# Altium schematic sheet Sheet3.SchDoc
size D
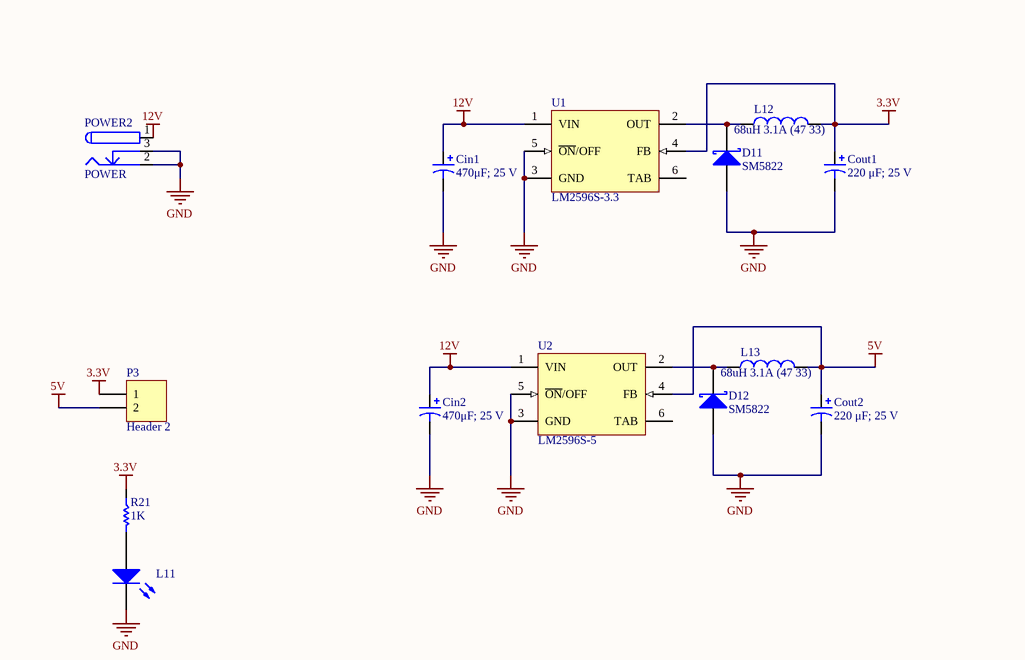
[diagram p0: Sheet3.SchDoc, top left]
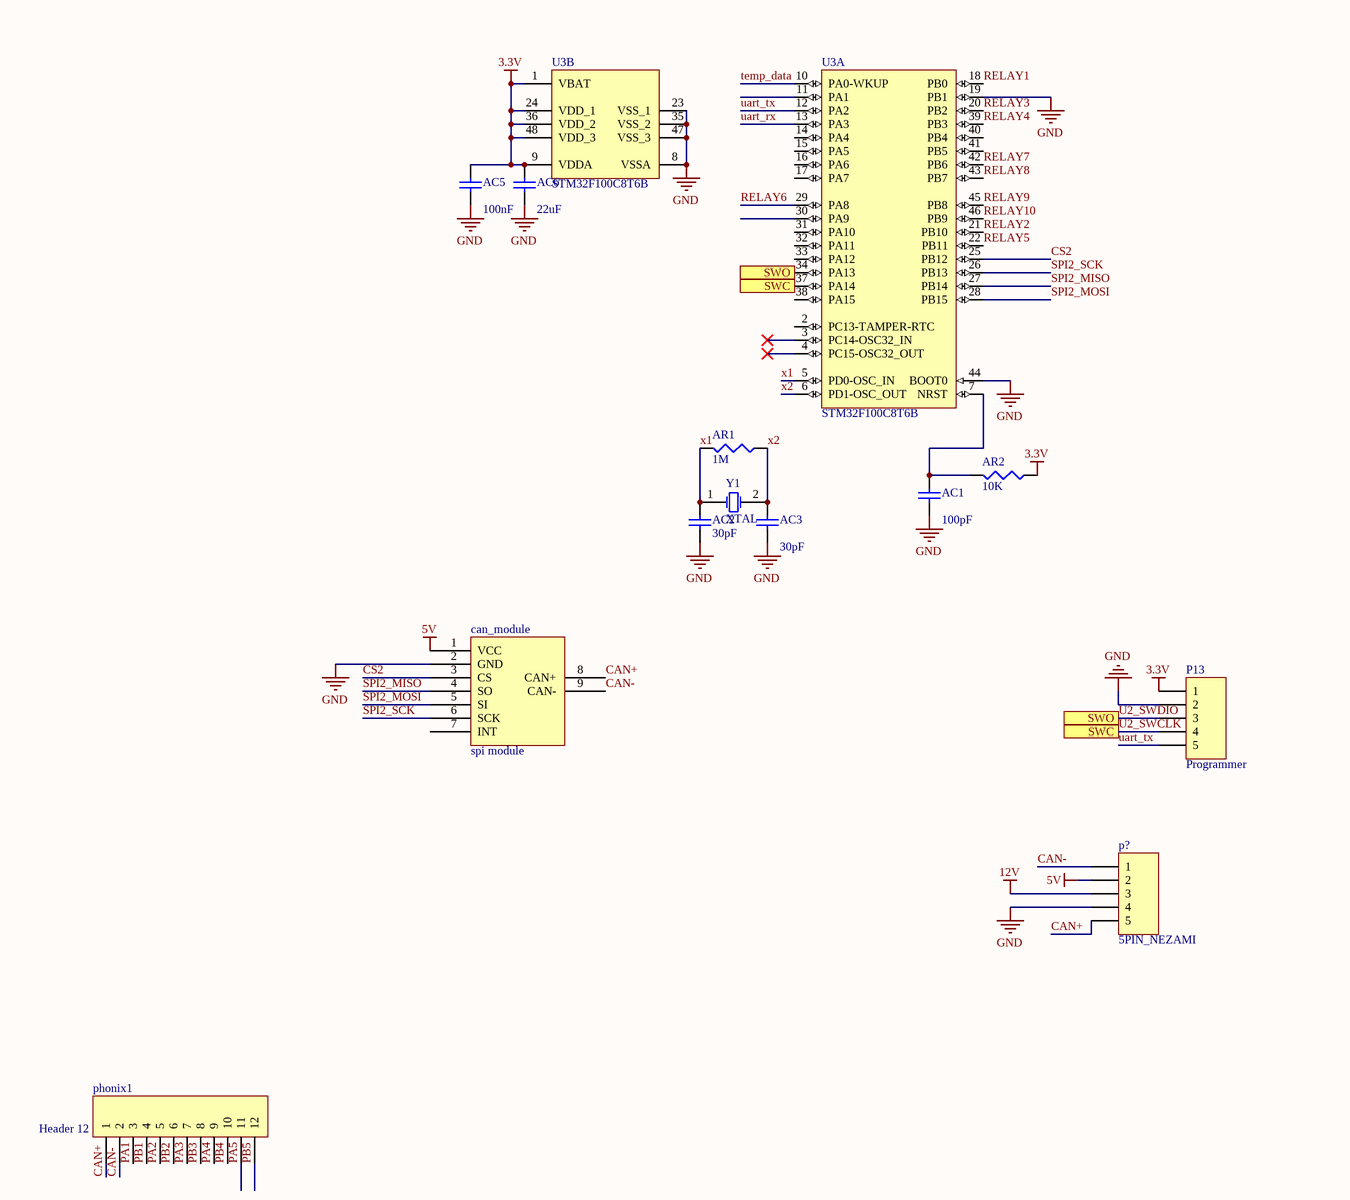
[diagram p1: Sheet3.SchDoc, top right]
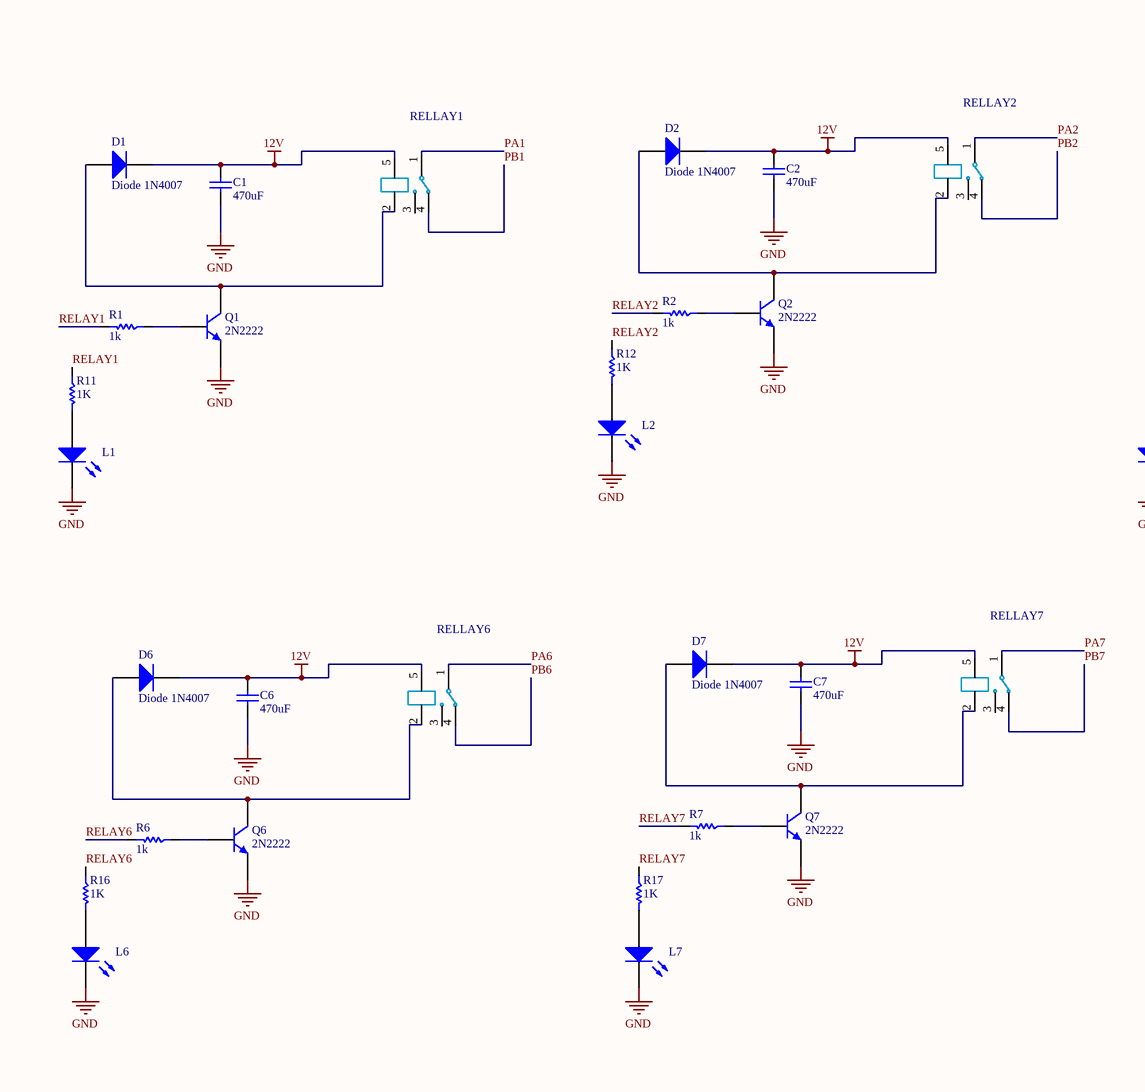
[diagram p2: Sheet3.SchDoc, bottom left]
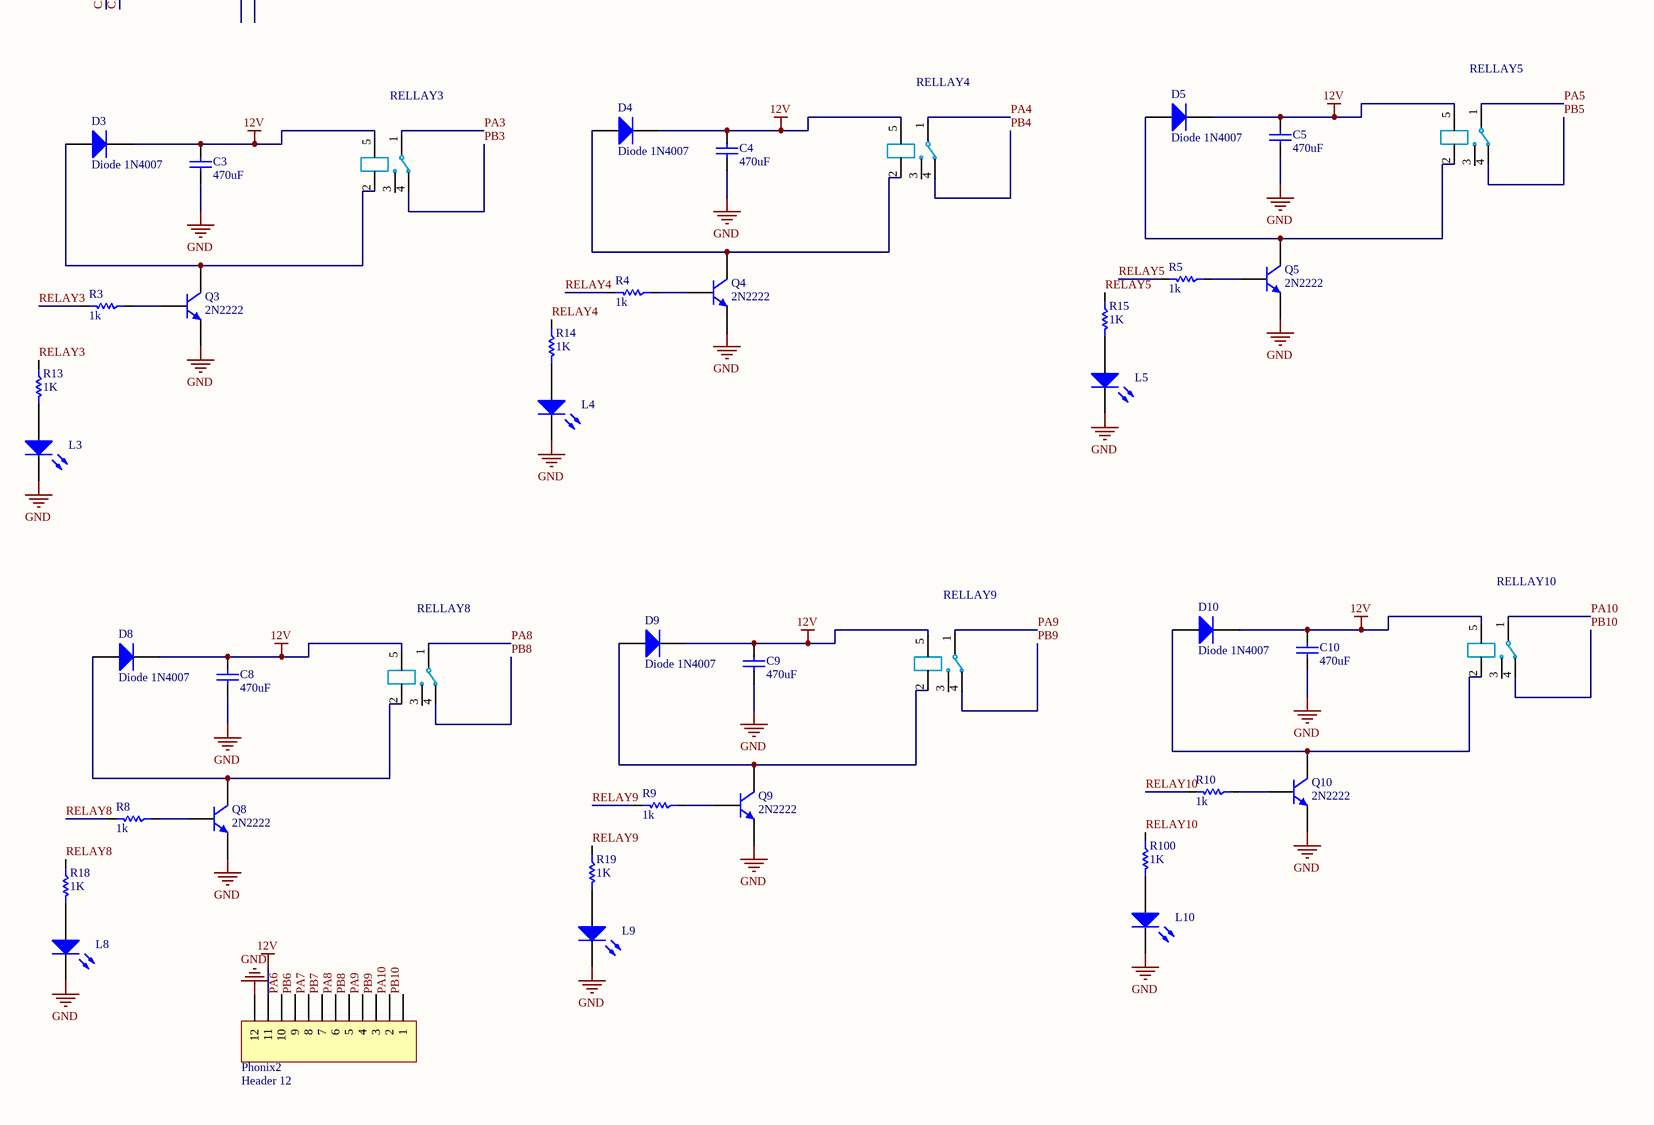
[diagram p3: Sheet3.SchDoc, bottom right]

## Parts
AC1  value 100pF  [C1206]  (hidden comment: Cap Semi)
AC2  value 30pF  [C1206]  (hidden comment: Cap Semi)
AC3  value 30pF  [C1206]  (hidden comment: Cap Semi)
AC5  value 100nF  [C1206]  (hidden comment: Cap Semi)
AC6  value 22uF  [C1206]  (hidden comment: Cap Semi)
AR1  value 1M  [c1206]  (hidden comment: Res3)
AR2  value 10K  [c1206]  (hidden comment: Res3)
C1  470uF  [F]
C2  470uF  [F]
C3  470uF  [F]
C4  470uF  [F]
C5  470uF  [F]
C6  470uF  [F]
C7  470uF  [F]
C8  470uF  [F]
C9  470uF  [F]
C10  470uF  [F]
can_module  spi module  [SPI_CAN]
Cin1  470μF; 25 V  [E]
Cin2  470μF; 25 V  [E]
Cout1  220 μF; 25 V  [E]
Cout2  220 μF; 25 V  [E]
D1  Diode 1N4007  [DO-41]
D2  Diode 1N4007  [DO-41]
D3  Diode 1N4007  [DO-41]
D4  Diode 1N4007  [DO-41]
D5  Diode 1N4007  [DO-41]
D6  Diode 1N4007  [DO-41]
D7  Diode 1N4007  [DO-41]
D8  Diode 1N4007  [DO-41]
D9  Diode 1N4007  [DO-41]
D10  Diode 1N4007  [DO-41]
D11  SM5822  [SMB]
D12  SM5822  [SMB]
L1  LED2  [LED]  (value not drawn)
L2  LED2  [LED]  (value not drawn)
L3  LED2  [LED]  (value not drawn)
L4  LED2  [LED]  (value not drawn)
L5  LED2  [LED]  (value not drawn)
L6  LED2  [LED]  (value not drawn)
L7  LED2  [LED]  (value not drawn)
L8  LED2  [LED]  (value not drawn)
L9  LED2  [LED]  (value not drawn)
L10  LED2  [LED]  (value not drawn)
L11  LED2  [LED]  (value not drawn)
L12  68uH 3.1A (47 33)  [CAPR5-4X5]
L13  68uH 3.1A (47 33)  [CAPR5-4X5]
P3  Header 2  [HDR1X2]
P13  Programmer  [HDR1X5]
p?  5PIN_NEZAMI  [5PIN_NEZAMI_CAN]
phonix1  Header 12  [phoenix terminal R 10]
Phonix2  Header 12  [phoenix terminal R 10]
POWER2  POWER  [POWERIN]
Q1  2N2222  [TO-92A]
Q2  2N2222  [TO-92A]
Q3  2N2222  [TO-92A]
Q4  2N2222  [TO-92A]
Q5  2N2222  [TO-92A]
Q6  2N2222  [TO-92A]
Q7  2N2222  [TO-92A]
Q8  2N2222  [TO-92A]
Q9  2N2222  [TO-92A]
Q10  2N2222  [TO-92A]
R1  1k  [C1206]
R2  1k  [C1206]
R3  1k  [C1206]
R4  1k  [C1206]
R5  1k  [C1206]
R6  1k  [C1206]
R7  1k  [C1206]
R8  1k  [C1206]
R9  1k  [C1206]
R10  1k  [C1206]
R11  1K  [1206]
R12  1K  [1206]
R13  1K  [1206]
R14  1K  [1206]
R15  1K  [1206]
R16  1K  [1206]
R17  1K  [1206]
R18  1K  [1206]
R19  1K  [1206]
R21  1K  [1206]
R100  1K  [1206]
RELLAY1  hjr-21ff-12v-12A  [RELAY3]  (value not drawn)
RELLAY2  hjr-21ff-12v-12A  [RELAY3]  (value not drawn)
RELLAY3  hjr-21ff-12v-12A  [RELAY3]  (value not drawn)
RELLAY4  hjr-21ff-12v-12A  [RELAY3]  (value not drawn)
RELLAY5  hjr-21ff-12v-12A  [RELAY3]  (value not drawn)
RELLAY6  hjr-21ff-12v-12A  [RELAY3]  (value not drawn)
RELLAY7  hjr-21ff-12v-12A  [RELAY3]  (value not drawn)
RELLAY8  hjr-21ff-12v-12A  [RELAY3]  (value not drawn)
RELLAY9  hjr-21ff-12v-12A  [RELAY3]  (value not drawn)
RELLAY10  hjr-21ff-12v-12A  [RELAY3]  (value not drawn)
U1  LM2596S-3.3  [TS5B_N]
U2  LM2596S-5  [TS5B_N]
U3  STM32F100C8T6B  [STM-LQFP48_N]  (parts A,B of 2)
Y1  XTAL  [RAD-0.2]

## Ports
SWC, SWO

## Nets
3.3V: AC5.1 AC6.1 AR2.1 Cout1.1 L12.2 P3.1 P13.1 R21.1 U1.4(FB) U3.1(VBAT) U3.9(VDDA) U3.24(VDD_1) U3.36(VDD_2) U3.48(VDD_3)
5V: can_module.1(VCC) Cout2.1 L13.2 P3.2 p?.2 U2.4(FB)
12V: C1.2 C2.2 C3.2 C4.2 C5.2 C6.2 C7.2 C8.2 C9.2 C10.2 Cin1.1 Cin2.1 D1.2(K) D2.2(K) D3.2(K) D4.2(K) D5.2(K) D6.2(K) D7.2(K) D8.2(K) D9.2(K) D10.2(K) p?.3 Phonix2.11 POWER2.1 RELLAY1.5 RELLAY2.5 RELLAY3.5 RELLAY4.5 RELLAY5.5 RELLAY6.5 RELLAY7.5 RELLAY8.5 RELLAY9.5 RELLAY10.5 U1.1(VIN) U2.1(VIN)
GND: AC1.2 AC2.2 AC3.2 AC5.2 AC6.2 C1.1 C2.1 C3.1 C4.1 C5.1 C6.1 C7.1 C8.1 C9.1 C10.1 can_module.2(GND) Cin1.2 Cin2.2 Cout1.2 Cout2.2 D11.1(A) D12.1(A) L1.2(K) L2.2(K) L3.2(K) L4.2(K) L5.2(K) L6.2(K) L7.2(K) L8.2(K) L9.2(K) L10.2(K) L11.2(K) P13.2 p?.4 Phonix2.12 POWER2.2 POWER2.3 Q1.1(E) Q2.1(E) Q3.1(E) Q4.1(E) Q5.1(E) Q6.1(E) Q7.1(E) Q8.1(E) Q9.1(E) Q10.1(E) U1.3(GND) U1.5(~{ON}/OFF) U2.3(GND) U2.5(~{ON}/OFF) U3.8(VSSA) U3.19(PB1) U3.23(VSS_1) U3.35(VSS_2) U3.44(BOOT0) U3.47(VSS_3)
CAN+: can_module.8(CAN+) p?.5 phonix1.1
CAN-: can_module.9(CAN-) p?.1 phonix1.2
CS2: can_module.3(CS) U3.25(PB12)
PA1: phonix1.3 RELLAY1.1
PA2: phonix1.5 RELLAY2.1
PA3: phonix1.7 RELLAY3.1
PA4: phonix1.9 RELLAY4.1
PA5: phonix1.11 RELLAY5.1
PA6: Phonix2.10 RELLAY6.1
PA7: Phonix2.8 RELLAY7.1
PA8: Phonix2.6 RELLAY8.1
PA9: Phonix2.4 RELLAY9.1
PA10: Phonix2.2 RELLAY10.1
PB1: phonix1.4 RELLAY1.4
PB2: phonix1.6 RELLAY2.4
PB3: phonix1.8 RELLAY3.4
PB4: phonix1.10 RELLAY4.4
PB5: phonix1.12 RELLAY5.4
PB6: Phonix2.9 RELLAY6.4
PB7: Phonix2.7 RELLAY7.4
PB8: Phonix2.5 RELLAY8.4
PB9: Phonix2.3 RELLAY9.4
PB10: Phonix2.1 RELLAY10.4
RELAY1: R1.2 R11.1 U3.18(PB0)
RELAY2: R2.2 R12.1 U3.21(PB10)
RELAY3: R3.2 R13.1 U3.20(PB2)
RELAY4: R4.2 R14.1 U3.39(PB3)
RELAY5: R5.2 R15.1 U3.22(PB11)
RELAY6: R6.2 R16.1 U3.29(PA8)
RELAY7: R7.2 R17.1 U3.42(PB6)
RELAY8: R8.2 R18.1 U3.43(PB7)
RELAY9: R9.2 R19.1 U3.45(PB8)
RELAY10: R10.2 R100.1 U3.46(PB9)
SPI2_MISO: can_module.4(SO) U3.27(PB14)
SPI2_MOSI: can_module.5(SI) U3.28(PB15)
SPI2_SCK: can_module.6(SCK) U3.26(PB13)
temp_data: U3.10(PA0-WKUP)
U2_SWCLK: P13.4 U3.37(PA14) ; port SWC
U2_SWDIO: P13.3 U3.34(PA13) ; port SWO
uart_rx: U3.13(PA3)
uart_tx: P13.5 U3.12(PA2)
x1: AC2.1 AR1.2 U3.5(PD0-OSC_IN) Y1.1(OSC1)
x2: AC3.1 AR1.1 U3.6(PD1-OSC_OUT) Y1.2(OSC2)
NetAC1_1: AC1.1 AR2.2 U3.7(NRST)
NetD1_1: D1.1(A) Q1.3(C) RELLAY1.2
NetD2_1: D2.1(A) Q2.3(C) RELLAY2.2
NetD3_1: D3.1(A) Q3.3(C) RELLAY3.2
NetD4_1: D4.1(A) Q4.3(C) RELLAY4.2
NetD5_1: D5.1(A) Q5.3(C) RELLAY5.2
NetD6_1: D6.1(A) Q6.3(C) RELLAY6.2
NetD7_1: D7.1(A) Q7.3(C) RELLAY7.2
NetD8_1: D8.1(A) Q8.3(C) RELLAY8.2
NetD9_1: D9.1(A) Q9.3(C) RELLAY9.2
NetD10_1: D10.1(A) Q10.3(C) RELLAY10.2
NetD11_2: D11.2(K) L12.1 U1.2(OUT)
NetD12_2: D12.2(K) L13.1 U2.2(OUT)
NetL1_1: L1.1(A) R11.2
NetL2_1: L2.1(A) R12.2
NetL3_1: L3.1(A) R13.2
NetL4_1: L4.1(A) R14.2
NetL5_1: L5.1(A) R15.2
NetL6_1: L6.1(A) R16.2
NetL7_1: L7.1(A) R17.2
NetL8_1: L8.1(A) R18.2
NetL9_1: L9.1(A) R19.2
NetL10_1: L10.1(A) R100.2
NetL11_1: L11.1(A) R21.2
NetQ1_2: Q1.2(B) R1.1
NetQ2_2: Q2.2(B) R2.1
NetQ3_2: Q3.2(B) R3.1
NetQ4_2: Q4.2(B) R4.1
NetQ5_2: Q5.2(B) R5.1
NetQ6_2: Q6.2(B) R6.1
NetQ7_2: Q7.2(B) R7.1
NetQ8_2: Q8.2(B) R8.1
NetQ9_2: Q9.2(B) R9.1
NetQ10_2: Q10.2(B) R10.1

Not connected (* = marked no-connect by the designer): can_module 7(INT); POWER2 1A 1B 2A 2B 3A 3B; RELLAY1 3; RELLAY2 3; RELLAY3 3; RELLAY4 3; RELLAY5 3; RELLAY6 3; RELLAY7 3; RELLAY8 3; RELLAY9 3; RELLAY10 3; U1 6(TAB); U2 6(TAB); U3 2(PC13-TAMPER-RTC) 3(PC14-OSC32_IN)* 4(PC15-OSC32_OUT)* 11(PA1) 14(PA4) 15(PA5) 16(PA6) 17(PA7) 30(PA9) 31(PA10) 32(PA11) 33(PA12) 38(PA15) 40(PB4) 41(PB5)

## Library data of the parts
AC1-AC3 AC5 AC6 = Cap Semi: Capacitor (Semiconductor SIM Model); Published: 8-Jun-2000; LatestRevisionDate: 29-May-2009; LatestRevisionNote: IPC-7351 Footprint Added.; PackageReference: C1206; Publisher: Altium Limited; PackageDescription: Chip Capacitor
AR1 AR2 = Res3: Resistor; Published: 8-Jun-2000; LatestRevisionDate: 29-May-2009; LatestRevisionNote: IPC-7351 Footprint Added.; PackageReference: J1-0603; Publisher: Altium Limited; PackageDescription: Chip Resistor
C1-C10 = Cap: Capacitor; STATE: NOT-AVAILABLE; TYPE: tantalum; Published: 8-Jun-2000; LatestRevisionDate: 17-Jul-2002; LatestRevisionNote: Re-released for DXP Platform.; PackageReference: RAD-0.3; Publisher: Altium Limited; PackageDescription: Radial Cap, Thru-Hole; 2 Leads; 0.3 in Pin Spacing
Cin1 Cin2 Cout1 Cout2 = 94SH107X0016EBP: Solid Aluminum Capacitor with Organic Semiconductor Electrolyte: 100uF, 16V, Bulk Pack; Note: Part Numbers shown are for ± 20% capacitance tolerance (X0).; PCB_Layout: Complies with Manufacturer's Recommendation.; DrillSize: Nominal, Rounded to the nearest 0.1mm; Published: 19-Mar-2004; DatasheetDocument: 23-May-2001; PackageReference: E; Publisher: Altium Limited; ComponentLink1Description: Manufacturer Link; ComponentLink1URL: http://www.vishay.com/; ComponentLink2Description: Datasheet; ComponentLink2URL: http://www.vishay.com/docs/90006/94sh.pdf; Value: 100uF
D1-D10 = Diode 1N4001: 1 Amp General Purpose Rectifier; Published: 8-Jun-2000; LatestRevisionDate: 17-Jul-2002; LatestRevisionNote: Re-released for DXP Platform.; DatasheetVersion: 1998; PackageVersion: Aug-1999; PackageReference: DO-41; Publisher: Altium Limited; PackageDescription: Diode, Axial; Body 5.2 x 2.7 mm (LxDia. max), Lead Dia. 0.86 mm (max); Code_JEDEC: DO-204-AL; ComponentLink1Description: Manufacturer Link; ComponentLink1URL: http://www.fairchildsemi.com/; ComponentLink2Description: Datasheet; ComponentLink2URL: http://www.fairchildsemi.com/ds/1N%2F1N4001.pdf
D11 D12 = D Schottky: Schottky Diode; Published: 8-Jun-2000; LatestRevisionDate: 17-Jul-2002; LatestRevisionNote: Re-released for DXP Platform.; PackageReference: SMB; Publisher: Altium Limited; PackageDescription: DO-214-AA/SMB; 2 C-Bend Leads; Body 5.3 x 3.6 mm, inc. leads (LxW); Code_JEDEC: DO-214-AA
L1-L11 = LED2: Typical RED, GREEN, YELLOW, AMBER GaAs LED; Published: 8-Jun-2000; LatestRevisionDate: 17-Jul-2002; LatestRevisionNote: Re-released for DXP Platform.; PackageVersion: Feb-2002; PackageReference: 3.2X1.6X1.1; Publisher: Altium Limited; PackageDescription: SM LED; 2 Flat Leads
L12 L13 = Inductor: Code_IEC: 1005; Value: 10mH; Published: 8-Jun-2000; LatestRevisionDate: 29-May-2009; LatestRevisionNote: IPC-7351 Footprint Added.; PackageReference: 0402-A; Publisher: Altium Limited; PackageDescription: Chip Inductor; Code_JEITA: 0402
P3 = Header 2: Header, 2-Pin; LatestRevisionDate: 17-Jul-2002; LatestRevisionNote: Re-released for DXP Platform.; Publisher: Altium Limited
P13 = Header 5: Header, 5-Pin; LatestRevisionDate: 17-Jul-2002; LatestRevisionNote: Re-released for DXP Platform.; Publisher: Altium Limited
p? = 5PIN_NEZAMI: Header, 8-Pin; LatestRevisionDate: 17-Jul-2002; LatestRevisionNote: Re-released for DXP Platform.; Publisher: Altium Limited
phonix1 Phonix2 = Header 12: Header, 12-Pin; LatestRevisionDate: 17-Jul-2002; LatestRevisionNote: Re-released for DXP Platform.; Publisher: Altium Limited
POWER2 = PWR2.5: Low Voltage Power Supply Connector; Published: 17-Dec-2003; DatasheetDocument: 09-May-2002; Publisher: Altium Limited; ComponentLink1Description: Manufacturer Link; ComponentLink1URL: http://domino.kycon.com/internet/Products.html
Q1-Q10 = 2N3904: NPN General Purpose Amplifier; Published: 8-Jun-2000; LatestRevisionDate: 15-Jan-2003; LatestRevisionNote: PCB Footprint 'BCY-W3/D4.7' replaced; DatasheetVersion: 1997; PackageVersion: Sep-1998; PackageReference: TO-92A; Publisher: Altium Limited; PackageDescription: TO, Flat Index; 3 In-Line, Axial Leads; Body Dia. 4.5mm; Leads 0.51 x 0.48 mm (max); ComponentLink1Description: Manufacturer Link; ComponentLink1URL: http://www.fairchildsemi.com/; ComponentLink2Description: Datasheet; ComponentLink2URL: http://www.fairchildsemi.com/ds/2N%2F2N3904.pdf
R1-R19 R21 R100 = Resistor
  R1-R10: Value: 1k
  R11-R19 R21 R100: Value: 1K
RELLAY1-RELLAY10 = relaty 12V
U1 U2 = LM2596S-ADJ: SIMPLE SWITCHER® Power Converter 150 KHz 3A Step-Down Voltage Regulator, 5-pin TO-263; Manufacturer: National Semiconductor; PackageTopMarking: NSUZXYTTE#*LM2596S*-ADJ P+; PowerWise: N; Published: 4-Dec-2008; DatasheetVersion: May-2002; PackageVersion: revD, Apr-2005; PackageReference: TS5B; Publisher: Altium Limited; PackageDescription: TO-263, Molded, .400 x .390 x .180in, 5 Lead, .067in Pitch, Surface Mount; Supplier 1: Farnell; Supplier Part Number 1: 1523864; Supplier 2: Farnell; Supplier Part Number 2: 9494367; PartNumber: LM2596S-ADJ; RoHS: N; PinCount: 5; CompType: Switcher; Code_JEDEC: MO-169-AB; ComponentLink1Description: LM2596 Datasheet; ComponentLink1URL: http://www.national.com/ds/LM/LM2596.pdf; ComponentLink2Description: LM2596 Web Page; ComponentLink2URL: http://www.national.com/pf/LM/LM2596.html; ComponentLink3Description: TS5B Package Page; ComponentLink3URL: http://www.national.com/packaging/folders/ts5b.html
U3 = STM32F100C8T6B: ARM Cortex-M3 32-bit MCU, 64 KB Flash, 8 KB Internal RAM, 37 I/Os, 48-pin LQFP, -40 to 85 degC, Tray; A/D Converter: 1x12-bit (10 Channel); D/A Converter: 2x12-bit (2 Channel); FLASH Size (Prog) (kB): 64; I/Os (High Current): 37; Internal RAM Size (kB): 8; Operating Frequency(F) (Processor speed) (MHz): 24; Supply Voltage(Vcc) min (V): 2; DatasheetVersion: Rev. 7; PackageVersion: Rev. 6, 06/2013; PackageReference: LQFP48; PackageDescription: 48-Pin Low Profile Quad Flat Package, 7 x 7 mm Body, 0.5 mm Pitch; Supplier 1: Digi-Key; Supplier Part Number 1: 497-10499-ND; Supplier 2: Farnell; Supplier Part Number 2: 1838511; Supplier 3: Newark; Supplier Part Number 3: 76R0988; Supplier 4: Mouser; Supplier Part Number 4: 511-STM32F100C8T6B; Core: ARM Cortex-M3; Packing: Tray; Mounting Technology: Surface Mount; PartNumber: STM32F100C8T6B; ComponentLink1Description: Manufacturer URL; ComponentLink1URL: http://www.st.com/web/en/home.html; ComponentLink2Description: Datasheet; ComponentLink2URL: http://www.st.com/st-web-ui/static/active/en/resource/technical/document/datasheet/CD00251732.pdf; ComponentLink3Description: Package Specification; ComponentLink3URL: http://www.st.com/st-web-ui/static/active/en/resource/technical/document/datasheet/DM00058181.pdf
Y1 = XTAL: Crystal Oscillator; Published: 8-Jun-2000; LatestRevisionDate: 17-Jul-2002; LatestRevisionNote: Re-released for DXP Platform.; PackageReference: R38; Publisher: Altium Limited; PackageDescription: Crystal, Thru-Hole; 2 Leads; Body 3.1 x 8.2 mm (Dia.xH)